# Altium schematic sheet Controle.SchDoc
size A2; SheetNumber: 1; SheetTotal: 4
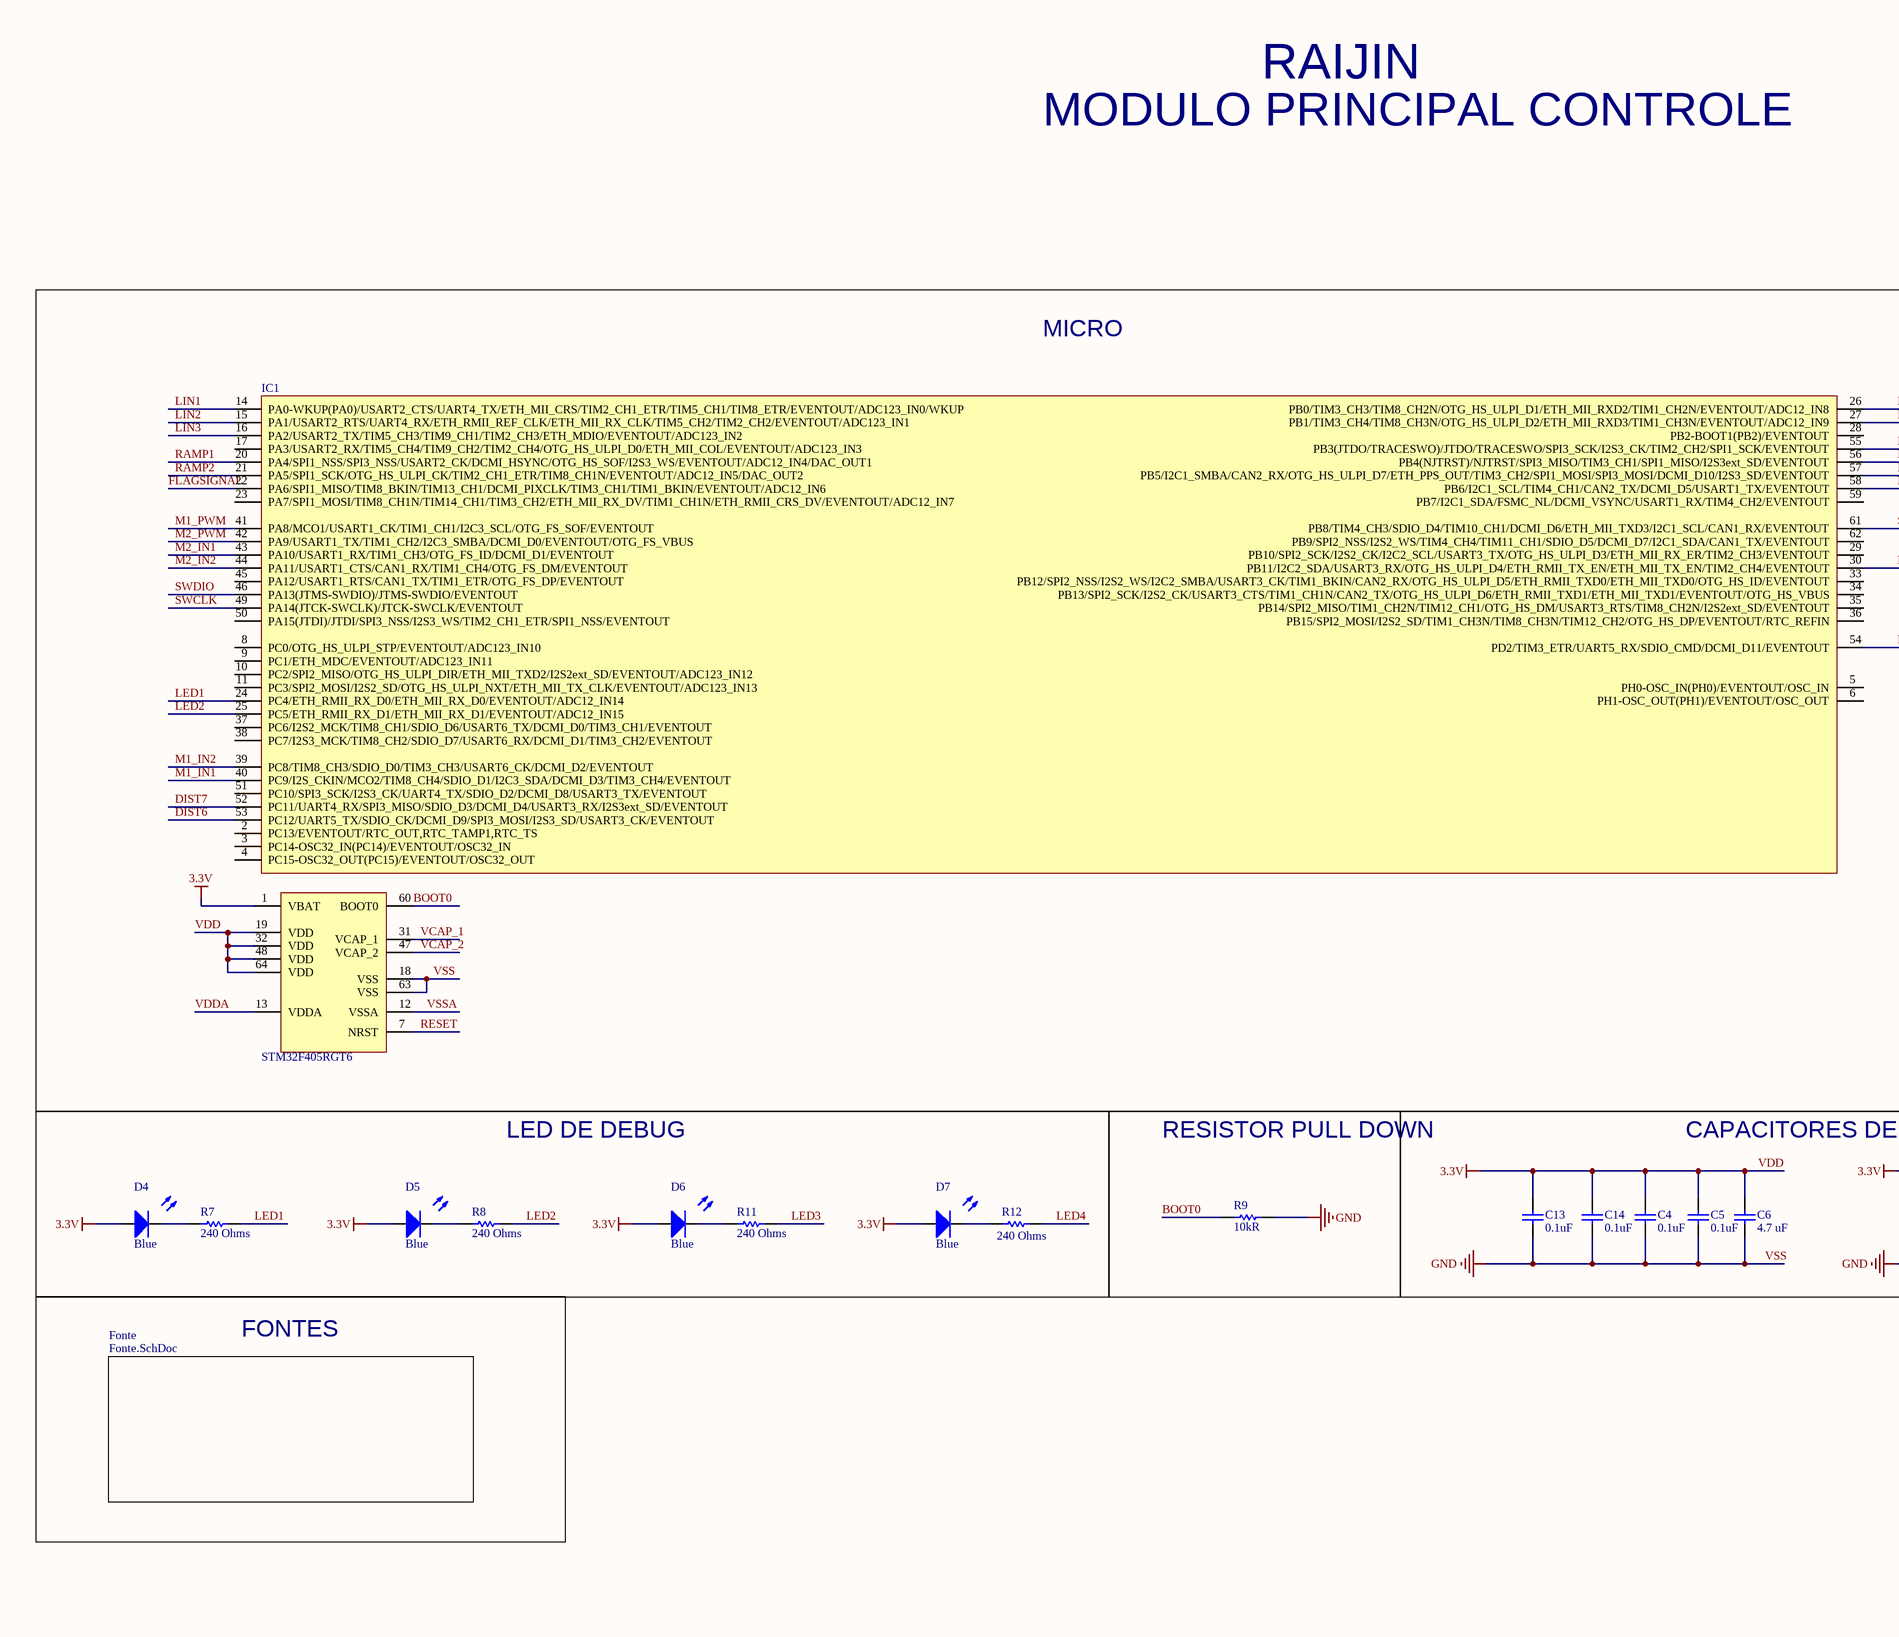
[diagram p0: Controle.SchDoc, left]
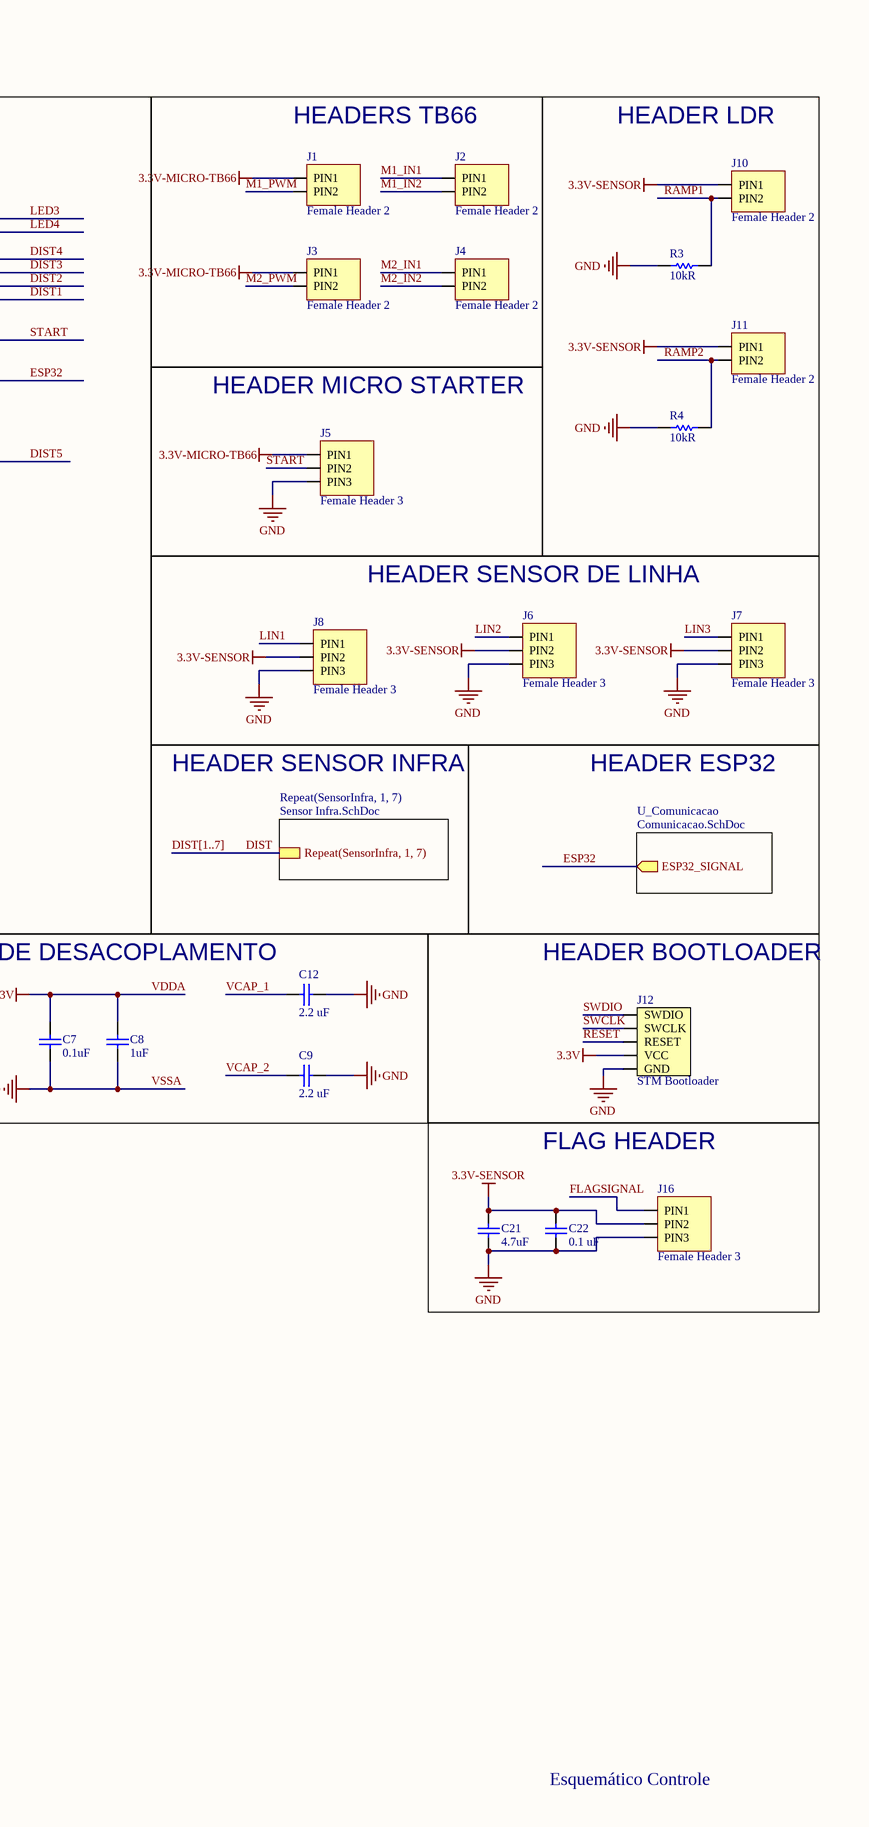
[diagram p1: Controle.SchDoc, right]

## Parts
C4  0.1uF  [CAPC1005X55N]
C5  0.1uF  [CAPC1005X55N]
C6  4.7 uF  [C0603]
C7  0.1uF  [CAPC1005X55N]
C8  1uF  [C0805]
C9  2.2 uF  [C0402]
C12  2.2 uF  [C0402]
C13  0.1uF  [CAPC1005X55N]
C14  0.1uF  [CAPC1005X55N]
C21  4.7uF  [C0603]
C22  0.1 uF  [C0603]
D4  Blue  [DIODO_2-SMD-3215]
D5  Blue  [DIODO_2-SMD-3215]
D6  Blue  [DIODO_2-SMD-3215]
D7  Blue  [DIODO_2-SMD-3215]
IC1  STM32F405RGT6  [LQFP-64]
J1  Female Header 2  [Female Header 2]
J2  Female Header 2  [Female Header 2]
J3  Female Header 2  [Female Header 2]
J4  Female Header 2  [Female Header 2]
J5  Female Header 3  [FEMALE HEADER 3]
J6  Female Header 3  [FEMALE HEADER 3]
J7  Female Header 3  [FEMALE HEADER 3]
J8  Female Header 3  [FEMALE HEADER 3]
J10  Female Header 2  [Female Header 2]
J11  Female Header 2  [Female Header 2]
J12  STM Bootloader  [STM BOOTLOADER]
J16  Female Header 3  [FEMALE HEADER 3]
R3  10kR  [RESISTOR_0402]
R4  10kR  [RESISTOR_0402]
R7  240 Ohms  [RESC1608X55N]
R8  240 Ohms  [RESC1608X55N]
R9  10kR  [RESISTOR_0402]
R11  240 Ohms  [RESC1608X55N]
R12  240 Ohms  [RESC1608X55N]

## Blocks framed on the sheet
MICRO: IC1
HEADERS TB66: J1-J4
HEADER LDR: J10 J11 R3 R4
HEADER MICRO STARTER: J5
HEADER SENSOR DE LINHA: J6-J8
LED DE DEBUG: D4-D7 R7 R8 R11 R12
RESISTOR PULL DOWN: R9
CAPACITORES DE DESACOPLAMENTO: C4-C9 C12-C14
HEADER BOOTLOADER: J12
FLAG HEADER: C21 C22 J16

## Sub-sheets
Fonte = Fonte.SchDoc: no entries
Repeat(SensorInfra, 1, 7) = Sensor Infra.SchDoc: Repeat(SensorInfra, 1, 7)
U_Comunicacao = Comunicacao.SchDoc: ESP32_SIGNAL (out)

## Nets
3.3V-MICRO-TB66: J1.PIN1 J3.PIN1 J5.PIN1
3.3V-SENSOR: C21.2 C22.2 J6.PIN2 J7.PIN2 J8.PIN2 J10.PIN1 J11.PIN1 J16.PIN2
VDD: C4.2 C5.2 C6.2 C7.2 C8.2 C13.2 C14.2 D4.A D5.A D6.A D7.A IC1.1(VBAT) IC1.13(VDDA) IC1.19(VDD) IC1.32(VDD) IC1.48(VDD) IC1.64(VDD) J12.VCC  [also labelled 3.3V, VDDA]
VSS: C4.1 C5.1 C6.1 C7.1 C8.1 C9.1 C12.1 C13.1 C14.1 C21.1 C22.1 IC1.12(VSSA) IC1.18(VSS) IC1.63(VSS) J5.PIN3 J6.PIN3 J7.PIN3 J8.PIN3 J12.GND J16.PIN3 R3.1 R4.1 R9.2  [also labelled GND, VSSA]
BOOT0: IC1.60(BOOT0) R9.1
DIST: sheet Repeat(SensorInfra, 1, 7)/Repeat(SensorInfra, 1, 7)
DIST1: IC1.58(PB6/I2C1_SCL/TIM4_CH1/CAN2_TX/DCMI_D5/USART1_TX/EVENTOUT)
DIST2: IC1.57(PB5/I2C1_SMBA/CAN2_RX/OTG_HS_ULPI_D7/ETH_PPS_OUT/TIM3_CH2/SPI1_MOSI/SPI3_MOSI/DCMI_D10/I2S3_SD/EVENTOUT)
DIST3: IC1.56(PB4(NJTRST)/NJTRST/SPI3_MISO/TIM3_CH1/SPI1_MISO/I2S3ext_SD/EVENTOUT)
DIST4: IC1.55(PB3(JTDO/TRACESWO)/JTDO/TRACESWO/SPI3_SCK/I2S3_CK/TIM2_CH2/SPI1_SCK/EVENTOUT)
DIST5: IC1.54(PD2/TIM3_ETR/UART5_RX/SDIO_CMD/DCMI_D11/EVENTOUT)
DIST6: IC1.53(PC12/UART5_TX/SDIO_CK/DCMI_D9/SPI3_MOSI/I2S3_SD/USART3_CK/EVENTOUT)
DIST7: IC1.52(PC11/UART4_RX/SPI3_MISO/SDIO_D3/DCMI_D4/USART3_RX/I2S3ext_SD/EVENTOUT)
ESP32: IC1.30(PB11/I2C2_SDA/USART3_RX/OTG_HS_ULPI_D4/ETH_RMII_TX_EN/ETH_MII_TX_EN/TIM2_CH4/EVENTOUT) ; sheet U_Comunicacao/ESP32_SIGNAL
FLAGSIGNAL: IC1.22(PA6/SPI1_MISO/TIM8_BKIN/TIM13_CH1/DCMI_PIXCLK/TIM3_CH1/TIM1_BKIN/EVENTOUT/ADC12_IN6) J16.PIN1
LED1: IC1.24(PC4/ETH_RMII_RX_D0/ETH_MII_RX_D0/EVENTOUT/ADC12_IN14) R7.2
LED2: IC1.25(PC5/ETH_RMII_RX_D1/ETH_MII_RX_D1/EVENTOUT/ADC12_IN15) R8.2
LED3: IC1.26(PB0/TIM3_CH3/TIM8_CH2N/OTG_HS_ULPI_D1/ETH_MII_RXD2/TIM1_CH2N/EVENTOUT/ADC12_IN8) R11.2
LED4: IC1.27(PB1/TIM3_CH4/TIM8_CH3N/OTG_HS_ULPI_D2/ETH_MII_RXD3/TIM1_CH3N/EVENTOUT/ADC12_IN9) R12.2
LIN1: IC1.14(PA0-WKUP(PA0)/USART2_CTS/UART4_TX/ETH_MII_CRS/TIM2_CH1_ETR/TIM5_CH1/TIM8_ETR/EVENTOUT/ADC123_IN0/WKUP) J8.PIN1
LIN2: IC1.15(PA1/USART2_RTS/UART4_RX/ETH_RMII_REF_CLK/ETH_MII_RX_CLK/TIM5_CH2/TIM2_CH2/EVENTOUT/ADC123_IN1) J6.PIN1
LIN3: IC1.16(PA2/USART2_TX/TIM5_CH3/TIM9_CH1/TIM2_CH3/ETH_MDIO/EVENTOUT/ADC123_IN2) J7.PIN1
M1_IN1: IC1.40(PC9/I2S_CKIN/MCO2/TIM8_CH4/SDIO_D1/I2C3_SDA/DCMI_D3/TIM3_CH4/EVENTOUT) J2.PIN1
M1_IN2: IC1.39(PC8/TIM8_CH3/SDIO_D0/TIM3_CH3/USART6_CK/DCMI_D2/EVENTOUT) J2.PIN2
M1_PWM: IC1.41(PA8/MCO1/USART1_CK/TIM1_CH1/I2C3_SCL/OTG_FS_SOF/EVENTOUT) J1.PIN2
M2_IN1: IC1.43(PA10/USART1_RX/TIM1_CH3/OTG_FS_ID/DCMI_D1/EVENTOUT) J4.PIN1
M2_IN2: IC1.44(PA11/USART1_CTS/CAN1_RX/TIM1_CH4/OTG_FS_DM/EVENTOUT) J4.PIN2
M2_PWM: IC1.42(PA9/USART1_TX/TIM1_CH2/I2C3_SMBA/DCMI_D0/EVENTOUT/OTG_FS_VBUS) J3.PIN2
RAMP1: IC1.20(PA4/SPI1_NSS/SPI3_NSS/USART2_CK/DCMI_HSYNC/OTG_HS_SOF/I2S3_WS/EVENTOUT/ADC12_IN4/DAC_OUT1) J10.PIN2 R3.2
RAMP2: IC1.21(PA5/SPI1_SCK/OTG_HS_ULPI_CK/TIM2_CH1_ETR/TIM8_CH1N/EVENTOUT/ADC12_IN5/DAC_OUT2) J11.PIN2 R4.2
RESET: IC1.7(NRST) J12.RESET
START: IC1.61(PB8/TIM4_CH3/SDIO_D4/TIM10_CH1/DCMI_D6/ETH_MII_TXD3/I2C1_SCL/CAN1_RX/EVENTOUT) J5.PIN2
SWCLK: IC1.49(PA14(JTCK-SWCLK)/JTCK-SWCLK/EVENTOUT) J12.CLK(SWCLK)
SWDIO: IC1.46(PA13(JTMS-SWDIO)/JTMS-SWDIO/EVENTOUT) J12.DIO(SWDIO)
VCAP_1: C12.2 IC1.31(VCAP_1)
VCAP_2: C9.2 IC1.47(VCAP_2)
NetD4_C: D4.C R7.1
NetD5_C: D5.C R8.1
NetD6_C: D6.C R11.1
NetD7_C: D7.C R12.1

Not connected (* = marked no-connect by the designer): IC1 2(PC13/EVENTOUT/RTC_OUT,RTC_TAMP1,RTC_TS) 3(PC14-OSC32_IN(PC14)/EVENTOUT/OSC32_IN) 4(PC15-OSC32_OUT(PC15)/EVENTOUT/OSC32_OUT) 5(PH0-OSC_IN(PH0)/EVENTOUT/OSC_IN) 6(PH1-OSC_OUT(PH1)/EVENTOUT/OSC_OUT) 8(PC0/OTG_HS_ULPI_STP/EVENTOUT/ADC123_IN10) 9(PC1/ETH_MDC/EVENTOUT/ADC123_IN11) 10(PC2/SPI2_MISO/OTG_HS_ULPI_DIR/ETH_MII_TXD2/I2S2ext_SD/EVENTOUT/ADC123_IN12) 11(PC3/SPI2_MOSI/I2S2_SD/OTG_HS_ULPI_NXT/ETH_MII_TX_CLK/EVENTOUT/ADC123_IN13) 17(PA3/USART2_RX/TIM5_CH4/TIM9_CH2/TIM2_CH4/OTG_HS_ULPI_D0/ETH_MII_COL/EVENTOUT/ADC123_IN3) 23(PA7/SPI1_MOSI/TIM8_CH1N/TIM14_CH1/TIM3_CH2/ETH_MII_RX_DV/TIM1_CH1N/ETH_RMII_CRS_DV/EVENTOUT/ADC12_IN7) 28(PB2-BOOT1(PB2)/EVENTOUT) 29(PB10/SPI2_SCK/I2S2_CK/I2C2_SCL/USART3_TX/OTG_HS_ULPI_D3/ETH_MII_RX_ER/TIM2_CH3/EVENTOUT) 33(PB12/SPI2_NSS/I2S2_WS/I2C2_SMBA/USART3_CK/TIM1_BKIN/CAN2_RX/OTG_HS_ULPI_D5/ETH_RMII_TXD0/ETH_MII_TXD0/OTG_HS_ID/EVENTOUT) 34(PB13/SPI2_SCK/I2S2_CK/USART3_CTS/TIM1_CH1N/CAN2_TX/OTG_HS_ULPI_D6/ETH_RMII_TXD1/ETH_MII_TXD1/EVENTOUT/OTG_HS_VBUS) 35(PB14/SPI2_MISO/TIM1_CH2N/TIM12_CH1/OTG_HS_DM/USART3_RTS/TIM8_CH2N/I2S2ext_SD/EVENTOUT) 36(PB15/SPI2_MOSI/I2S2_SD/TIM1_CH3N/TIM8_CH3N/TIM12_CH2/OTG_HS_DP/EVENTOUT/RTC_REFIN) 37(PC6/I2S2_MCK/TIM8_CH1/SDIO_D6/USART6_TX/DCMI_D0/TIM3_CH1/EVENTOUT) 38(PC7/I2S3_MCK/TIM8_CH2/SDIO_D7/USART6_RX/DCMI_D1/TIM3_CH2/EVENTOUT) 45(PA12/USART1_RTS/CAN1_TX/TIM1_ETR/OTG_FS_DP/EVENTOUT) 50(PA15(JTDI)/JTDI/SPI3_NSS/I2S3_WS/TIM2_CH1_ETR/SPI1_NSS/EVENTOUT) 51(PC10/SPI3_SCK/I2S3_CK/UART4_TX/SDIO_D2/DCMI_D8/USART3_TX/EVENTOUT) 59(PB7/I2C1_SDA/FSMC_NL/DCMI_VSYNC/USART1_RX/TIM4_CH2/EVENTOUT) 62(PB9/SPI2_NSS/I2S2_WS/TIM4_CH4/TIM11_CH1/SDIO_D5/DCMI_D7/I2C1_SDA/CAN1_TX/EVENTOUT)

## Buses and harness runs
bus DIST[1..7]

## Notes on the sheet
- RAIJIN
- MODULO PRINCIPAL CONTROLE
- HEADER SENSOR INFRA
- HEADER ESP32
- FONTES
- Esquemático Controle

## Library data of the parts
C4 C5 C7 C13 C14 = GRM155R61C104KA88D: CAP CER 0.1uF 16V X5R 0402; Manufacturer: Murata; Tolerance: 10%; Library Control - Checked Footprint: Yes; Library Control - Person that Checked Footprint: Guilherme; Supplier 1: Mouser; Part Number: GRM155R61C104KA88D; Category: Ceramic Capacitors; Price: 1 = 0,10, 10=0,024, 100=0,011 (USD); Supplier Part Number 1: 81-GRM155R61C104KA8D; Library Ref: Capacitor; Operating Temperature: -55°C ~ 85°C; Package / Case: 0402 (1005 Metric); Size / Dimension: 1,0 L x 0,5 W x 0,5 H; Value: 0.1uF; Voltage - Rated: 16V; ESR: -; Dieletric: X5R; Library Control - Checked Schematic: Yes; Library Control - Last Update: 24/07/2021 11:05; Library Control - Person that Checked Schematic: Guilherme; Library Control - Person that did the Last Update Footprint: Guilherme; Library Control - Person that did the Last Update Schematic: Guilherme; ComponentLink1Description: Datasheet; ComponentLink1URL: https://br.mouser.com/datasheet/2/281/1/GRM155R61C104KA88_01A-1983743.pdf; ComponentLink2Description: Mouser Link; ComponentLink2URL: https://br.mouser.com/ProductDetail/Murata-Electronics/GRM155R61C104KA88D?qs=%2Fha2pyFadugsr51Fgcs3VGJIvx6dQb2fpcJyrxDKYTBEoW5q5paGTQ%3D%3D
C6 = GRM188R61C475KAAJD: CAP CER 4.7uF 16V X5R 0603; Manufacturer: MURATA ELECTRONICS; Tolerance: 10%; Voltage - Rated: 16 VDC; ESR: 100mΩ; Library Control - Checked Schematic: Guilherme; Library Control - Person that did the Last Update Footprint: Raquel; Library Control - Person that did the Last Update Schematic: Marcos; Supplier 1: Mouser; Part Number: GRM188R61C475KAAJD; Category: Ceramic capacitor; Price: 1=0,39, 10=0,27, 100=0,172, 1000=0,153 (USD); Supplier Part Number 1: 81-GRM188R61C475KAJD; Library Ref: Capacitor; Operating Temperature: -55°C ~ 85ºC; Package / Case: 0603(1608 metric); Size / Dimension: 1.6 mm L x 0.8 mm W x 0.8 mm H; Value: 4.7 uF; Dieletric: X5R; Library Control - Last Update: 27/06/2021 16:02; Library Control - Person that Checked Schematic: Guilherme; ComponentLink1Description: Datasheet; ComponentLink1URL: https://br.mouser.com/datasheet/2/281/murata_03052018_GRM_Series_1-1310166.pdf; ComponentLink2Description: Mouser Link; ComponentLink2URL: https://br.mouser.com/ProductDetail/Murata-Electronics/GRM188R61C475KAAJD?qs=mJtAphxf33T5qOjL9fHG9Q%3D%3D
C8 = CC0805ZRY5V8BB105: CAP CER 1uF 25V Y5V 0805; Manufacturer: Yageo; Tolerance: -20%, +80%; ESR: 0.05; Library Control - Checked Footprint: Yes; Library Control - Person that Checked Footprint: Nikaum; Supplier 1: Mouser; Part Number: CC0805ZRY5V8BB105; Category: Ceramic Capacitor; Price: 1=0.21, 10=0.151, 100=0.071 (USD); Supplier Part Number 1: 603-CC805KRX7R9BB331; Library Ref: Capacitor; Operating Temperature: -30 C ~ 85 C; Package / Case: 0805 (2012 Metric); Size / Dimension: 2,00 L x 1,25 W x 0,85 H; Value: 1uF; Voltage - Rated: 25V; Dieletric: Y5V; Library Control - Checked Schematic: Yes; Library Control - Last Update: 27/06/2021 23:54; Library Control - Person that Checked Schematic: Nikaum; Library Control - Person that did the Last Update Footprint: NIkaum; Library Control - Person that did the Last Update Schematic: Nikaum; ComponentLink1Description: Datasheet; ComponentLink1URL: https://br.mouser.com/datasheet/2/447/yago_s_a0004841839_1-2286631.pdf; ComponentLink2Description: Mouser Link; ComponentLink2URL: https://br.mouser.com/ProductDetail/Yageo/CC0805ZRY5V8BB105?qs=%2Fha2pyFaduhNpscxq1sti%2FWGfef5%252B7abNQFh0pSFqzoFpwPoZWE8UM%252BupYNGXIAb
C9 C12 = C1005X5R1C225M050BC: CAP CER 2.2UF 16V X5R 0402; Manufacturer: TDK; Tolerance: 20%; Voltage - Rated: 16 VDC; Library Control - Checked Footprint: Yes; Library Control - Person that Checked Footprint: Nikaum; Supplier 1: Mouser; Part Number: C1005X5R1C225M050BC; Category: Ceramic Capacitor; Price: 1= 0,35, 10= 0,24, 100= 0,137 (USD); Supplier Part Number 1: 810-C1005X5R1C225M; Library Ref: Capacitor; Operating Temperature: -55 C ~ 85 C; Package / Case: 0402 (1005 Metric); Size / Dimension: 1,00 L x 0,50 W x 0,50 H; Value: 2.2 uF; Dieletric: X5R; Library Control - Checked Schematic: Yes; Library Control - Last Update: 28/06/2021 00:25; Library Control - Person that Checked Schematic: Nikaum; Library Control - Person that did the Last Update Footprint: Nikaum; Library Control - Person that did the Last Update Schematic: Nikaum; ComponentLink1Description: Datasheet; ComponentLink1URL: https://product.tdk.com/system/files/dam/doc/product/capacitor/ceramic/mlcc/catalog/mlcc_commercial_general_en.pdf; ComponentLink2Description: Mouser Link; ComponentLink2URL: https://br.mouser.com/ProductDetail/TDK/C1005X5R1C225M050BC?qs=%2Fha2pyFaduhU5KeTuzJ6cgu5msb4qv%252BHR3wvbG6WdO9o%252B44FZFkWvfar1ahjHCOq; ComponentLink3Description: ESR; ComponentLink3URL: https://product.tdk.com/en/search/capacitor/ceramic/mlcc/info?part_no=C1005X5R1C225M050BC
C21 = CC0603KRX5R8BB475: CAP CER 4.7uF 25V X5R 0603; Manufacturer: Yageo; Tolerance: 10%; ESR: 0.05; Library Control - Checked Footprint: Yes; Library Control - Person that Checked Footprint: Nikaum; Supplier 1: Mouser; Part Number: CC0603KRX5R8BB475; Category: Ceramic Capacitor; Price: 1=0.25, 10=0.164, 100=0,093 (USD); Supplier Part Number 1: 603-CC0603KRX58BB475; Library Ref: Capacitor; Operating Temperature: -55 C ~ 125 C; Package / Case: 0603 (1608 Metric); Size / Dimension: 1,60 L x 0,80 W x 0,87 H; Value: 4.7uF; Voltage - Rated: 25V; Dieletric: X5R; Library Control - Checked Schematic: Yes; Library Control - Last Update: 27/06/2021 23:47; Library Control - Person that Checked Schematic: Nikaum; Library Control - Person that did the Last Update Footprint: Nikaum; Library Control - Person that did the Last Update Schematic: Nikaum; ComponentLink1Description: Datasheet; ComponentLink1URL: https://br.mouser.com/datasheet/2/447/yago_s_a0011397150_1-2286655.pdf; ComponentLink2Description: Mouser Link; ComponentLink2URL: https://br.mouser.com/ProductDetail/Yageo/CC0603KRX5R8BB475?qs=%2Fha2pyFaduh%2F7Q8z%252B7Ot0eflSx5gYDgPHryPFxzpgCUeMwc25ZtPlNgXae48%252BTjy
C22 = C0603C104M5RACTU: CAP CER 0.1uF 50V X7R 0603; Manufacturer: Kemet; Tolerance: 20%; Voltage - Rated: 50 VDC; Library Control - Checked Footprint: Yes; Library Control - Person that Checked Footprint: Stéfany (Ster); Supplier 1: Mouser; Part Number: C0603C104M5RACTU; Category: Ceramic Capacitor; Price: 1=0,22 10=0,154 100=0.106 (USD); Supplier Part Number 1: 80-C0603C104M5R; Library Ref: Capacitor; Operating Temperature: -55°C ~ 125°C; Package / Case: 0603(1608 metric); Size / Dimension: 1.6 L x 0.8 W x 0.8 H (USD); Value: 0.1 uF; Dieletric: X7R; Library Control - Checked Schematic: Yes; Library Control - Last Update: 09/09/2021 15:15; Library Control - Person that Checked Schematic: Stéfany (Ster); Library Control - Person that did the Last Update Schematic: Stéfany (Ster); ComponentLink1Description: Datasheet; ComponentLink1URL: https://br.mouser.com/datasheet/2/212/KEM_C1002_X7R_SMD-1102033.pdf; ComponentLink2Description: Mouser Link; ComponentLink2URL: https://br.mouser.com/ProductDetail/KEMET/C0603C104M5RACTU?qs=YkRtRX%252BfoqJT%252B0m410IP4A%3D%3D; ComponentLink3Description: ESR; ComponentLink3URL: https://www.kemet.com/en/us/capacitors/ceramic/product/C0603C104M5RACTU.html
D4-D7 = EAST3215BA5: LED 75mW BLUE 45MCD 3215; Manufacturer: Everlight Electronics; Current - Forward (If): 20 mA; Voltage - Forward (Vf): 3,30 V; Viewing Angle: 130°; Wavelength: 468 nm; Reverse Voltage: 5 V; Library Control - Checked Footprint: yes; Library Control - Person that Checked Footprint: Lucas; Library Control - Person that did the Last Update Footprint: Stéfany (Ster); Supplier 1: Mouser; Part Number: EAST3215BA5; Category: Standard LEDs - SMD; Price: 1 = 0,3800, 10 = 0,2050, 100 = 0.1080 (USD); Package / Case: 3215; Color: Blue; Operating Temperature: - 40 °C ~ 85 °C; Luminous Intensity: 45 mcd; Library Ref: Diodo/Led; Supplier Part Number 1: 638-EAST3215BA5; Max Power Dissipation: 75 mW; Max Current Rating: 20 mA; Library Control - Checked Schematic: yes; Library Control - Last Update: 13/06/2021 12:45; Library Control - Person that Checked Schematic: Lucas; Library Control - Person that did the Last Update Schematic: Stéfany (Ster); ComponentLink1Description: Mouser Link; ComponentLink1URL: https://www.mouser.com/ProductDetail/Everlight/EAST3215BA5?qs=Cqqh%252BS766wnzp9nQVj5A4g==; ComponentLink2Description: Datasheet; ComponentLink2URL: https://www.mouser.com/datasheet/2/143/EAST3215BA5-1154292.pdf
IC1 = STM32F405RGT6: IC MCU 32-BIT 192kB FLASH ARM Cortex-M4 168MHz  LQFP-64; Manufacturer: STM; Number of I/Os: 51; Oscillator Type: Internal; Program Memory Size: 1024kB; Peripherals: CAN, I2C, SDIO, I2S / SPI, UART / USART, USB; Core Processor: ARM Cortex M0+; Voltage - Supply (Vcc/Vdd): 1.8 V to 3.6 V; Number of Timers/Counters: 17; Number of ADC Channels: 16; Library Control - Person that did the Last Update Footprint: Marcos; Supplier 1: Mouser; Part Number: STM32F405RGT6; Category: ARM Microcontrollers - MCU; Price: 1 = 12,95, 10 = 11,91,  100 = 11,42, 500 = 8,95 (USD); Package/Case: LQFP-64; Operating Temperature: -40°C to 85°C; Connectivity: -; Speed: 168MHz; Program Memory Type: Flash; RAM Size: 192k B; Core Size: *; Number of SPI Channels: -; Number of I2C Channels: -; Number of UART/USART Channels: -; Number of Ethernet Channels: -; Series: STM32F405RG; Library Ref: Microcrontrollers; Supplier Part Number 1: 511-STM32F405RGT6; Library Control - Checked Footprint: *; Library Control - Checked Schematic: *; Library Control - Last Project that Used: *; Library Control - Last Update: *; Library Control - Person that Checked Footprint: *; Library Control - Person that Checked Schematic: *; Library Control - Person that did the Last Update Schematic: Marcos; ComponentLink1Description: Mouser Link; ComponentLink1URL: https://www.mouser.com/ProductDetail/STMicroelectronics/STM32G030J6M6?qs=uwxL4vQweFMe%2Fiu4dY6izA%3D%3D; ComponentLink2Description: Datasheet Link; ComponentLink2URL: https://www.mouser.com/datasheet/2/389/dm00613878-1799578.pdf
J1-J4 J10 J11 = Female Header 2: System: Connector
J5-J8 J16 = Female Header 3: Number of Contacts: 3; System: Connector; Library Ref: Header
J12 = Barramento de Gravação STM: BARRAMENTO DE GRAVAÇÃO; Number of Contacts: 5; Library Ref: Header
R3 R4 R9 = RC0402JR-0710KL: RES SMD 10K OHM 5% 1/16W 0402; Manufacturer: Yageo; Temperature Coefficient: 100 PPM / C; Power Rating: 62.5 mW (1/16 W); Voltage Rating: 50 V; Library Control - Checked Footprint: Yes; Library Control - Person that Checked Footprint: Nikaum; Library Control - Person that did the Last Update Footprint: Dalarme; Supplier 1: Mouser; Part Number: RC0402JR-0710KL; Category: Thick Film Resistors - SMD; Price: 1=0,10, 10=0,01, 100=0,004 1000=0,003 (USD); Package / Case: 0402 (1005 Metric); Operating Temperature: -55 C ~ 155 C; Value: 10kR; Tolerance: 5 %; Library Ref: Resistor; Resistor Type: Fixo; Size / Dimension: 1 mm L x  0.5 mm W x  0.35 mm H; Supplier Part Number 1: 603-RC0402JR-0710KL; Library Control - Checked Schematic: Yes; Library Control - Last Update: 27/06/2021 20:59; Library Control - Person that Checked Schematic: Nikaum; Library Control - Person that did the Last Update Schematic: Nikaum; ComponentLink1Description: Mouser Link; ComponentLink1URL: https://br.mouser.com/ProductDetail/Yageo/RC0402JR-0710KL?qs=%2Fha2pyFadugksLQP8sr8wSFqaMq1e9zbbX4dfYXawN%252BqoBT8jIbVcw%3D%3D; ComponentLink2Description: Datasheet Link; ComponentLink2URL: https://br.mouser.com/datasheet/2/447/PYu_RC_Group_51_RoHS_L_10-1664068.pdf
R7 R8 R11 R12 = RC0603FR-07240RL: RES SMD 240 OHM 1% 1/10W 0603; Manufacturer: YAGEO; Temperature Coefficient: 100 PPM / C; Power Rating: 1/10 W (100 mW); Supplier 1: Mouser; Part Number: RC0603FR-07240RL; Category: Current Sense Resistors - SMD; Price: 1= 0,10, 10= 0,024, 100= 0,01 (USD); Package / Case: 0603 (1608 metric); Operating Temperature: -55C ~ +155C; Value: 240 Ohms; Tolerance: 1%; Voltage Rating: -; Library Ref: Resistor; Resistor Type: Fixed; Size / Dimension: 1.6mm L x 0.8mm W x 0.45mm H; Supplier Part Number 1: 603-RC0603FR-07240RL; ComponentLink1Description: Mouser Link; ComponentLink1URL: https://br.mouser.com/ProductDetail/YAGEO/RC0603FR-07240RL?qs=%2Fha2pyFaduiUxY9aBc7vYsXmDGghjtsAaASQnplf3Fe6IIYOTbEeqCNZ6k5LKUyr; ComponentLink2Description: Datasheet; ComponentLink2URL: https://br.mouser.com/datasheet/2/447/Yageo_03_18_2021_PYu_RC_Group_51_RoHS_L_11-2199992.pdf